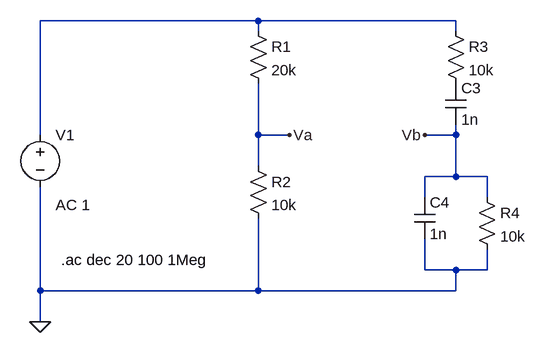
[diagram p0: schematic wien_robinson.asc]
wien_robinson.asc, the LTspice schematic file:
Version 4
SHEET 1 880 680
WIRE 112 80 -224 80
WIRE 416 80 112 80
WIRE 112 96 112 80
WIRE 416 96 416 80
WIRE -224 256 -224 80
WIRE 112 256 112 176
WIRE 160 256 112 256
WIRE 416 256 416 240
WIRE 416 256 368 256
WIRE 112 304 112 256
WIRE 416 320 416 256
WIRE 416 320 368 320
WIRE 464 320 416 320
WIRE 368 352 368 320
WIRE 464 352 464 320
WIRE 368 464 368 416
WIRE 416 464 368 464
WIRE 464 464 464 432
WIRE 464 464 416 464
WIRE -224 496 -224 336
WIRE 112 496 112 384
WIRE 112 496 -224 496
WIRE 416 496 416 464
WIRE 416 496 112 496
WIRE -224 544 -224 496
FLAG -224 544 0
FLAG 160 256 Va
FLAG 368 256 Vb
SYMBOL cap 400 176 R0
SYMATTR InstName C3
SYMATTR Value 1n
SYMBOL cap 352 352 R0
SYMATTR InstName C4
SYMATTR Value 1n
SYMBOL res 96 80 R0
SYMATTR InstName R1
SYMATTR Value 20k
SYMBOL res 96 288 R0
SYMATTR InstName R2
SYMATTR Value 10k
SYMBOL res 400 80 R0
SYMATTR InstName R3
SYMATTR Value 10k
SYMBOL res 448 336 R0
SYMATTR InstName R4
SYMATTR Value 10k
SYMBOL voltage -224 240 R0
WINDOW 123 24 124 Left 2
WINDOW 39 0 0 Left 2
SYMATTR Value2 AC 1
SYMATTR InstName V1
SYMATTR Value ""
TEXT -192 448 Left 2 !.ac dec 20 100 1Meg

The netlist it stands for:
* wien_robinson.asc
C3 P001 Vb 1n
C4 Vb 0 1n
R1 N001 Va 20k
R2 Va 0 10k
R3 N001 P001 10k
R4 Vb 0 10k
V1 N001 0 AC 1
.ac dec 20 100 1Meg
.backanno
.end